# EAGLE schematic VM_Motor_v2.3 (EAGLE 7.0.0)
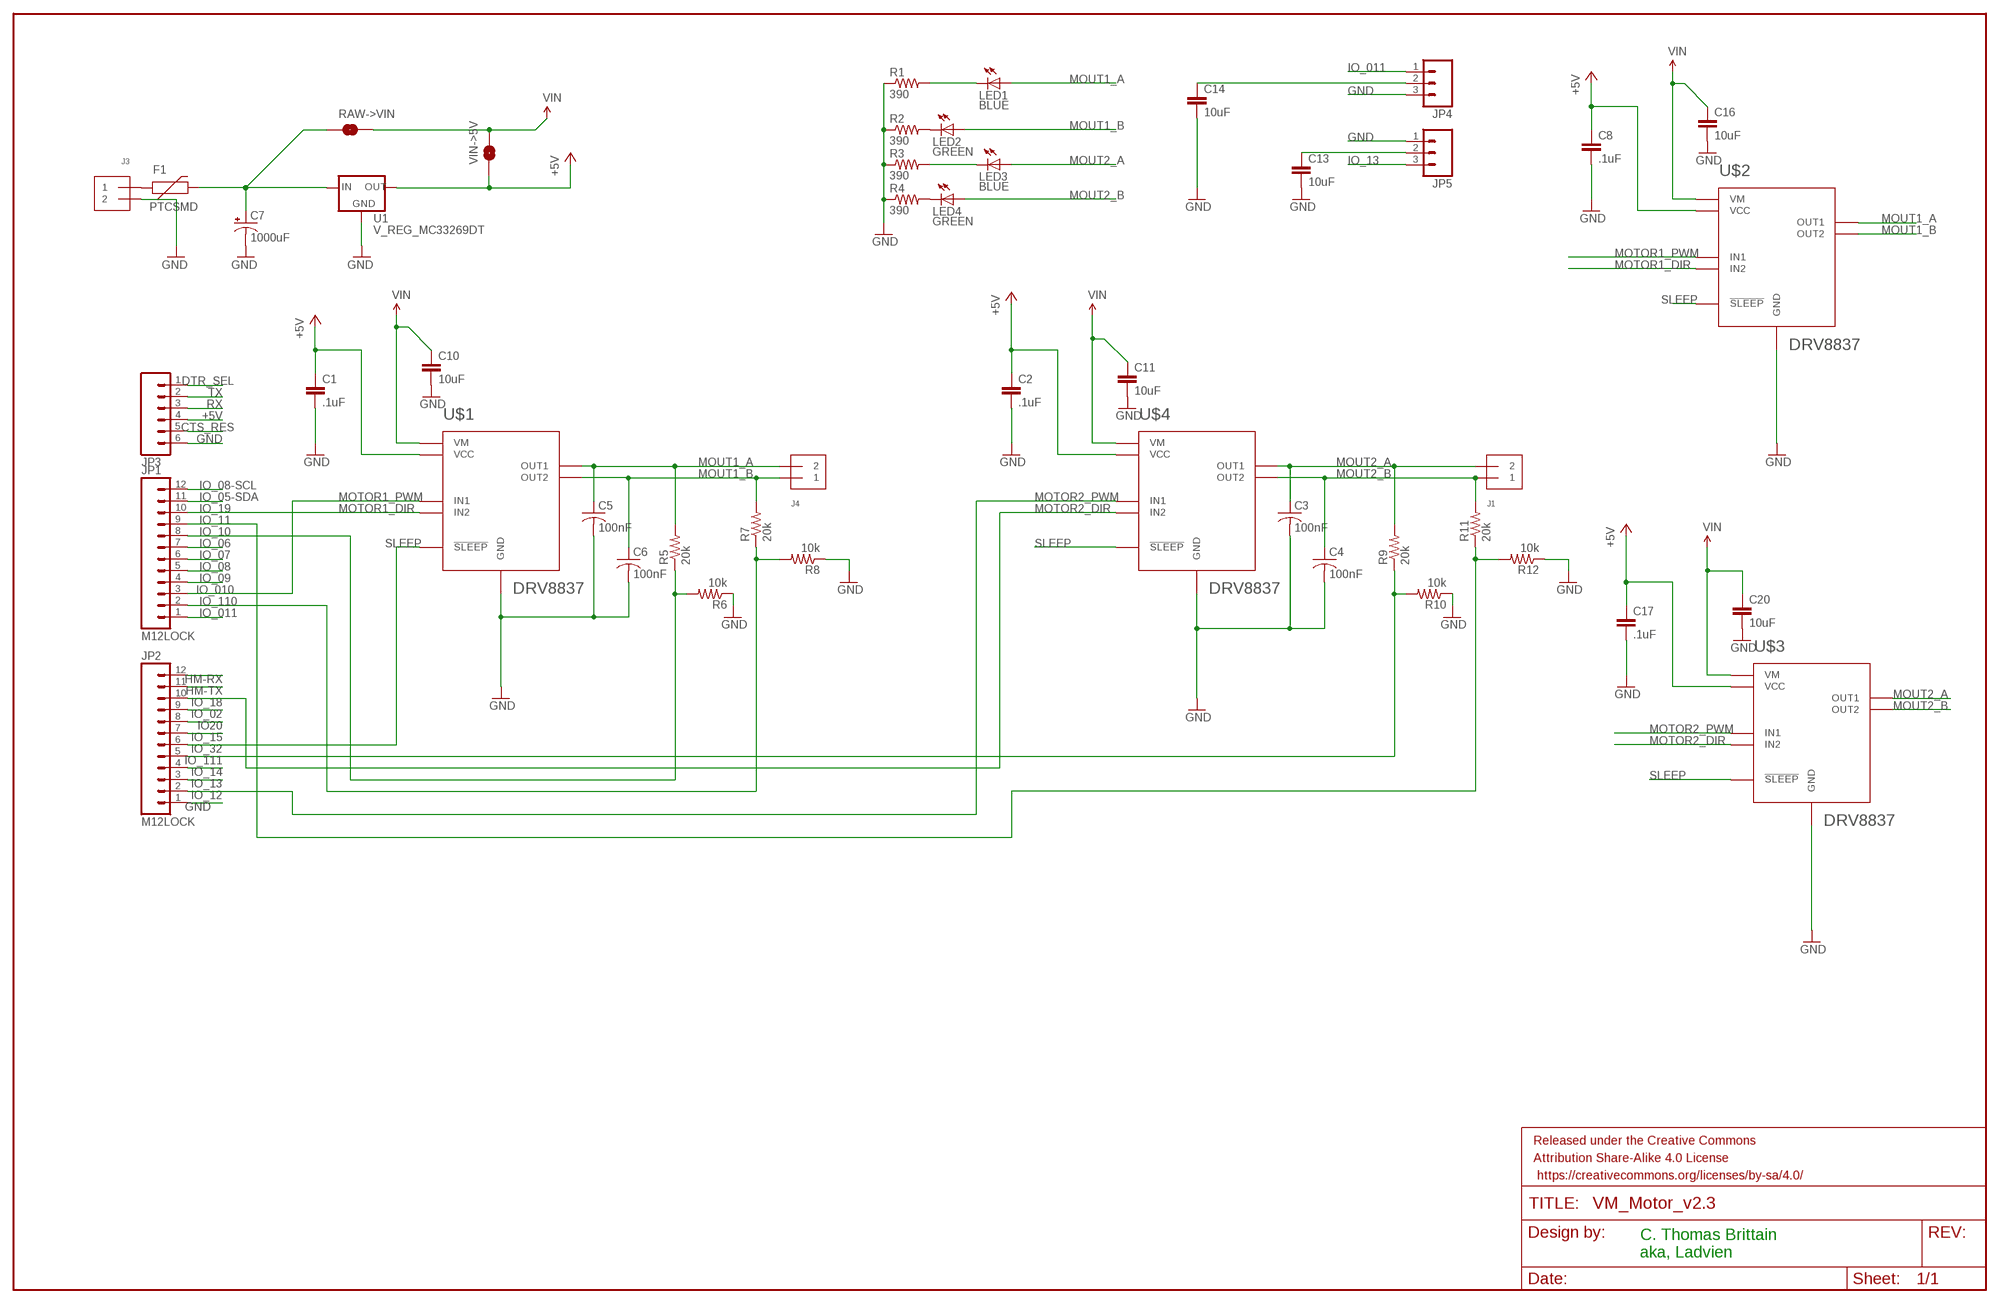
[diagram p0: schematic, sheet 1]

## Parts
C1  .1uF  CAP0402-CAP  [0402-CAP]
C2  .1uF  CAP0402-CAP  [0402-CAP]
C3  100nF  C-USC0402  [C0402]
C4  100nF  C-USC0402  [C0402]
C5  100nF  C-USC0402  [C0402]
C6  100nF  C-USC0402  [C0402]
C7  1000uF  CPOL-US150CLZ-0810  [150CLZ-0810]
C8  .1uF  CAP0402-CAP  [0402-CAP]
C10  10uF  CAP0402-CAP  [0402-CAP]
C11  10uF  CAP0402-CAP  [0402-CAP]
C13  10uF  CAP0402-CAP  [0402-CAP]
C14  10uF  CAP0402-CAP  [0402-CAP]
C16  10uF  CAP0402-CAP  [0402-CAP]
C17  .1uF  CAP0402-CAP  [0402-CAP]
C20  10uF  CAP0402-CAP  [0402-CAP]
F1  PTCSMD  [PTC-1206]
FRAME1  FRAME-LEDGER  [CREATIVE_COMMONS]
J1  TERMBLOCK_1X2  [TERMBLOCK_1X2-3.5MM]
J3  TERMBLOCK_1X2  [TERMBLOCK_1X2-3.5MM]
J4  TERMBLOCK_1X2  [TERMBLOCK_1X2-3.5MM]
JP1  M12LOCK  [1X12_LOCK]
JP2  M12LOCK  [1X12_LOCK]
JP3  M06LOCK  [1X06_LOCK]
JP4  M03LOCK  [1X03_LOCK]
JP5  M03LOCK  [1X03_LOCK]
LED1  BLUE  LEDCHIP-LED0603  [CHIP-LED0603]
LED2  GREEN  LEDCHIP-LED0603  [CHIP-LED0603]
LED3  BLUE  LEDCHIP-LED0603  [CHIP-LED0603]
LED4  GREEN  LEDCHIP-LED0603  [CHIP-LED0603]
R1  390  R-US_R0402  [R0402]
R2  390  R-US_R0402  [R0402]
R3  390  R-US_R0402  [R0402]
R4  390  R-US_R0402  [R0402]
R5  20k  R-US_R0402  [R0402]
R6  10k  R-US_R0402  [R0402]
R7  20k  R-US_R0402  [R0402]
R8  10k  R-US_R0402  [R0402]
R9  20k  R-US_R0402  [R0402]
R10  10k  R-US_R0402  [R0402]
R11  20k  R-US_R0402  [R0402]
R12  10k  R-US_R0402  [R0402]
RAW->VIN  SOLDERJUMPERNO  [SJ_2S-NO]
U1  V_REG_MC33269DT  [DPAK]
U$1  DRV8837  [QFN8]
U$2  DRV8837  [QFN8]
U$3  DRV8837  [QFN8]
U$4  DRV8837  [QFN8]
VIN->5V  SOLDERJUMPERNO  [SJ_2S-NO]

## Nets
+5V: C1.1 C2.1 C8.1 C13.1 C14.1 C17.1 JP3.4 JP4.2 JP5.2 U1.4(OUT) U$1.P$8(VCC) U$2.P$8(VCC) U$3.P$8(VCC) U$4.P$8(VCC) VIN->5V.1
CTS_RES: JP3.5
DTR_SEL: JP3.1
GND: C1.2 C2.2 C3.2 C4.2 C5.2 C6.2 C7.- C8.2 C10.2 C11.2 C13.2 C14.2 C16.2 C17.2 C20.2 J3.2 JP2.1 JP3.6 JP4.3 JP5.1 R1.1 R2.1 R3.1 R4.1 R6.1 R8.1 R10.1 R12.1 U1.1(GND) U$1.P$4(GND) U$1.P$9(GND) U$1.P$10(GND) U$1.P$11(GND) U$2.P$4(GND) U$2.P$9(GND) U$2.P$10(GND) U$2.P$11(GND) U$3.P$4(GND) U$3.P$9(GND) U$3.P$10(GND) U$3.P$11(GND) U$4.P$4(GND) U$4.P$9(GND) U$4.P$10(GND) U$4.P$11(GND)
HM-RX: JP2.12
HM-TX: JP2.11
IO20: JP2.8
IO_02: JP2.9
IO_05-SDA: JP1.11
IO_06: JP1.7
IO_07: JP1.6
IO_08: JP1.5
IO_08-SCL: JP1.12
IO_09: JP1.4
IO_10: JP1.8 R5.1 R6.2
IO_011: JP1.1 JP4.1
IO_11: JP1.9 R11.1 R12.2
IO_13: JP2.3 JP5.3
IO_14: JP2.4
IO_15: JP2.7
IO_110: JP1.2 R7.1 R8.2
IO_111: JP2.5 R9.1 R10.2
MOTOR1_DIR: JP1.10 U$1.P$5(IN2) U$2.P$5(IN2)
MOTOR1_PWM: JP1.3 U$1.P$6(IN1) U$2.P$6(IN1)
MOTOR2_DIR: JP2.10 U$3.P$5(IN2) U$4.P$5(IN2)
MOTOR2_PWM: JP2.2 U$3.P$6(IN1) U$4.P$6(IN1)
MOUT1_A: C5.1 J4.2 LED1.A R5.2 U$1.P$2(OUT1) U$2.P$2(OUT1)
MOUT1_B: C6.1 J4.1 LED2.A R7.2 U$1.P$3(OUT2) U$2.P$3(OUT2)
MOUT2_A: C3.1 J1.2 LED3.A R9.2 U$3.P$2(OUT1) U$4.P$2(OUT1)
MOUT2_B: C4.1 J1.1 LED4.A R11.2 U$3.P$3(OUT2) U$4.P$3(OUT2)
N$1: LED2.C R2.2
N$2: LED4.C R4.2
N$3: LED1.C R1.2
N$4: LED3.C R3.2
N$13: F1.1 J3.1
RAW: C7.+ F1.2 RAW->VIN.1 U1.3(IN)
RX: JP3.3
SLEEP: JP2.6 U$1.P$7(!SLEEP) U$2.P$7(!SLEEP) U$3.P$7(!SLEEP) U$4.P$7(!SLEEP)
TX: JP3.2
VIN: C10.1 C11.1 C16.1 C20.1 RAW->VIN.2 U$1.P$1(VM) U$2.P$1(VM) U$3.P$1(VM) U$4.P$1(VM) VIN->5V.2

## Notes on the sheet
- IO_19
- IO_11
- IO_010
- IO_18
- IO_32
- IO_12
- C. Thomas Brittain
  aka, Ladvien

## Library data of the parts
C1 C2 C8 C10 C11 C13 C14 C16 C17 C20 = SparkFun-Capacitors:CAP: Capacitor Standard 0603 ceramic capacitor, and 0.1" leaded capacitor.
C3-C6 = resistor:C-US: CAPACITOR, American symbol
C7 = resistor:CPOL-US: POLARIZED CAPACITOR, American symbol
F1 = SparkFun-PowerIC:PTC: Resettable Fuse PTC Resettable Fuse. Spark Fun Electronics SKU : COM-08357; PROD_ID: RES-11150
FRAME1 = SparkFun-Aesthetics:FRAME-LEDGER: Schematic Frame Standard 11x14 US Ledger frame
J1 J3 J4 = microbuilder:TERMBLOCK_1X2: 3.5mm Terminal block http://www.ladyada.net/library/pcb/eaglelibrary.html
JP1 JP2 = SparkFun-Connectors:M12: Header 12 Standard 12-pin 0.1" header. Use with straight break away headers (SKU : PRT-00116), right angle break away headers (PRT-00553), swiss pins (PRT-00743), machine pins (PRT-00117), and female headers (PRT-00115).
JP3 = SparkFun-Connectors:M06: Header 6 Standard 6-pin 0.1" header. Use with straight break away headers (SKU : PRT-00116), right angle break away headers (PRT-00553), swiss pins (PRT-00743), machine pins (PRT-00117), and female headers (PRT-00115). Molex polarized connector foot print use with SKU : PRT-08094 with associated crimp pins and housings. NOTES ON THE VARIANTS LOCK and LOCK_LONGPADS... This footprint was designed to help hold the alignment of a through-hole component (i.e. 6-pin header) while soldering it into place. You may notice that each hole has been shifted either up or down by 0.005 of an inch from it's more standard position (which is a perfectly straight line). This slight alteration caused the pins (the squares in the middle) to touch the edges of the holes. Because they are alternating, it causes a "brace" to hold the component in place. 0.005 has proven to be the perfect amount of "off-center" position when using our standard breakaway headers. Although looks a little odd when you look at the bare footprint, once you have a header in there, the alteration is very hard to notice. Also,if you push a header all the way into place, it is covered up entirely on the bottom side. This idea of altering the position of holes to aid alignment will be further integrated into the Sparkfun Library for other footprints. It can help hold any component with 3 or more connection pins.
JP4 JP5 = SparkFun-Connectors:M03: Header 3 Standard 3-pin 0.1" header. Use with straight break away headers (SKU : PRT-00116), right angle break away headers (PRT-00553), swiss pins (PRT-00743), machine pins (PRT-00117), and female headers (PRT-00115). Molex polarized connector foot print use with SKU : PRT-08232 with associated crimp pins and housings.
LED1-LED4 = led:LED: LED OSRAM: - CHIPLED LG R971, LG N971, LY N971, LG Q971, LY Q971, LO R971, LY R971 LH N974, LH R974 LS Q976, LO Q976, LY Q976 LO Q996 - Hyper CHIPLED LW Q18S LB Q993, LB Q99A, LB R99A - SideLED LS A670, LO A670, LY A670, LG A670, LP A670 LB A673, LV A673, LT A673, LW A673 LH A674 LY A675 LS A676, LA A676, LO A676, LY A676, LW A676 LS A679, LY A679, LG A679 - Hyper Micro SIDELED® LS Y876, LA Y876, LO Y876, LY Y876 LT Y87S - SmartLED LW L88C, LW L88S LB L89C, LB L89S, LG L890 LS L89K, LO L89K, LY L89K LS L896, LA L896, LO L896, LY L896 - TOPLED LS T670, LO T670, LY T670, LG T670, LP T670 LSG T670, LSP T670, LSY T670, LOP T670, LYG T670 LG T671, LOG T671, LSG T671 LB T673, LV T673, LT T673, LW T673 LH T674 LS T676, LA T676, LO T676, LY T676, LB T676, LH T676, LSB T676, LW T676 LB T67C, LV T67C, LT T67C, LS T67K, LO T67K, LY T67K, LW E67C LS E67B, LA E67B, LO E67B, LY E67B, LB E67C, LV E67C, LT E67C LW T67C LS T679, LY T679, LG T679 LS T770, LO T770, LY T770, LG T770, LP T770 LB T773, LV T773, LT T773, LW T773 LH T774 LS E675, LA E675, LY E675, LS T675 LS T776, LA T776, LO T776, LY T776, LB T776 LHGB T686 LT T68C, LB T68C - Hyper Mini TOPLED® LB M676 - Mini TOPLED Santana® LG M470 LS M47K, LO M47K, LY M47K Source: http://www.osram.convergy.de LUXEON: - LUMILED® LXK2-PW12-R00, LXK2-PW12-S00, LXK2-PW14-U00, LXK2-PW14-V00 LXK2-PM12-R00, LXK2-PM12-S00, LXK2-PM14-U00 LXK2-PE12-Q00, LXK2-PE12-R00, LXK2-PE12-S00, LXK2-PE14-T00, LXK2-PE14-U00 LXK2-PB12-K00, LXK2-PB12-L00, LXK2-PB12-M00, LXK2-PB14-N00, LXK2-PB14-P00, LXK2-PB14-Q00 LXK2-PR12-L00, LXK2-PR12-M00, LXK2-PR14-Q00, LXK2-PR14-R00 LXK2-PD12-Q00, LXK2-PD12-R00, LXK2-PD12-S00 LXK2-PH12-R00, LXK2-PH12-S00 LXK2-PL12-P00, LXK2-PL12-Q00, LXK2-PL12-R00 Source: www.luxeon.com KINGBRIGHT: KA-3528ASYC Source: www.kingbright.com
R1-R12 = resistor:R-US_: RESISTOR, American symbol
RAW->VIN VIN->5V = SparkFun-Retired:SOLDERJUMPER: Solder Jumper Standard SMD solder jumper. Used to automate production. Two varients : Normally Open and Normally Closed are the same, but have different paste layers. NC will have a large amount of paste and should jumper during reflow.
U1 = SparkFun-PowerIC:V_REG_MC33269
U$1-U$4 = bt_motordriver:DRV8837: DRV8837 Low Voltage H-Bridge The DRV8837 provides an integrated motor-driver solution for cameras, consumer products, toys, and other low-voltage or battery-powered motion-control applications. The device has one H-bridge driver, and can drive one dc motor or one winding of a stepper motor, as well as other devices like solenoids. Reference: http://www.ti.com/lit/ds/symlink/drv8837.pdf